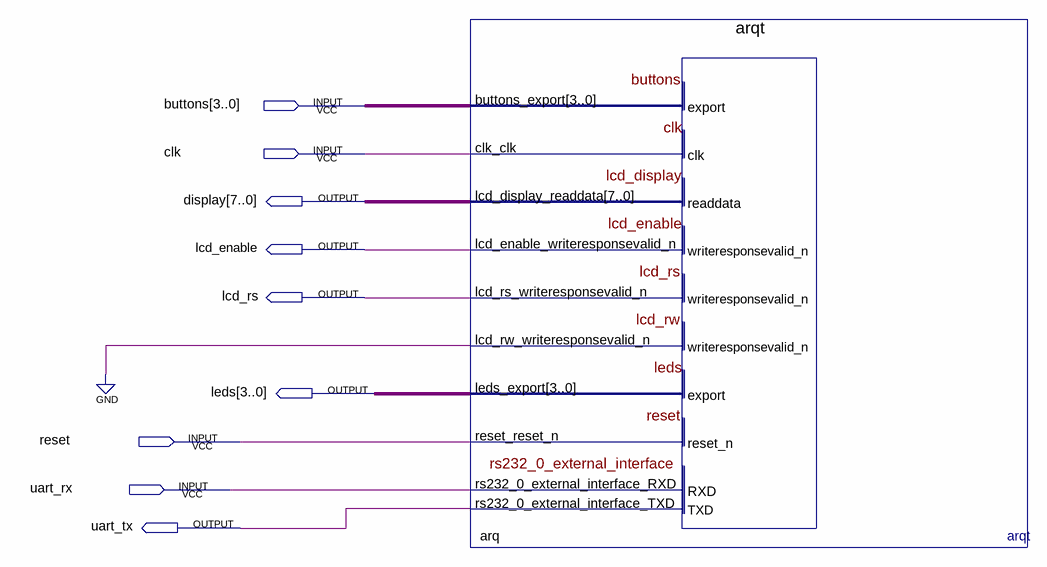
[diagram p0: schematic sheet]
// Quartus schematic problema1.bdf as structural Verilog: 1 symbols, 9 pins
module problema1 (
  input  [3:0] buttons,
  input  clk,
  input  reset,
  input  uart_rx,
  output [7:0] display,
  output lcd_enable,
  output lcd_rs,
  output [3:0] leds,
  output uart_tx
);

  wire arq_lcd_rw_writeresponsevalid_n;

  arqt arq (
    .buttons_export(buttons), .clk_clk(clk), .reset_reset_n(reset), .rs232_0_external_interface_RXD(uart_rx),
    .lcd_display_readdata(display), .lcd_enable_writeresponsevalid_n(lcd_enable),
    .lcd_rs_writeresponsevalid_n(lcd_rs), .lcd_rw_writeresponsevalid_n(arq_lcd_rw_writeresponsevalid_n),
    .leds_export(leds), .rs232_0_external_interface_TXD(uart_tx));
  // also tied to GND on the sheet: arq_lcd_rw_writeresponsevalid_n
endmodule
